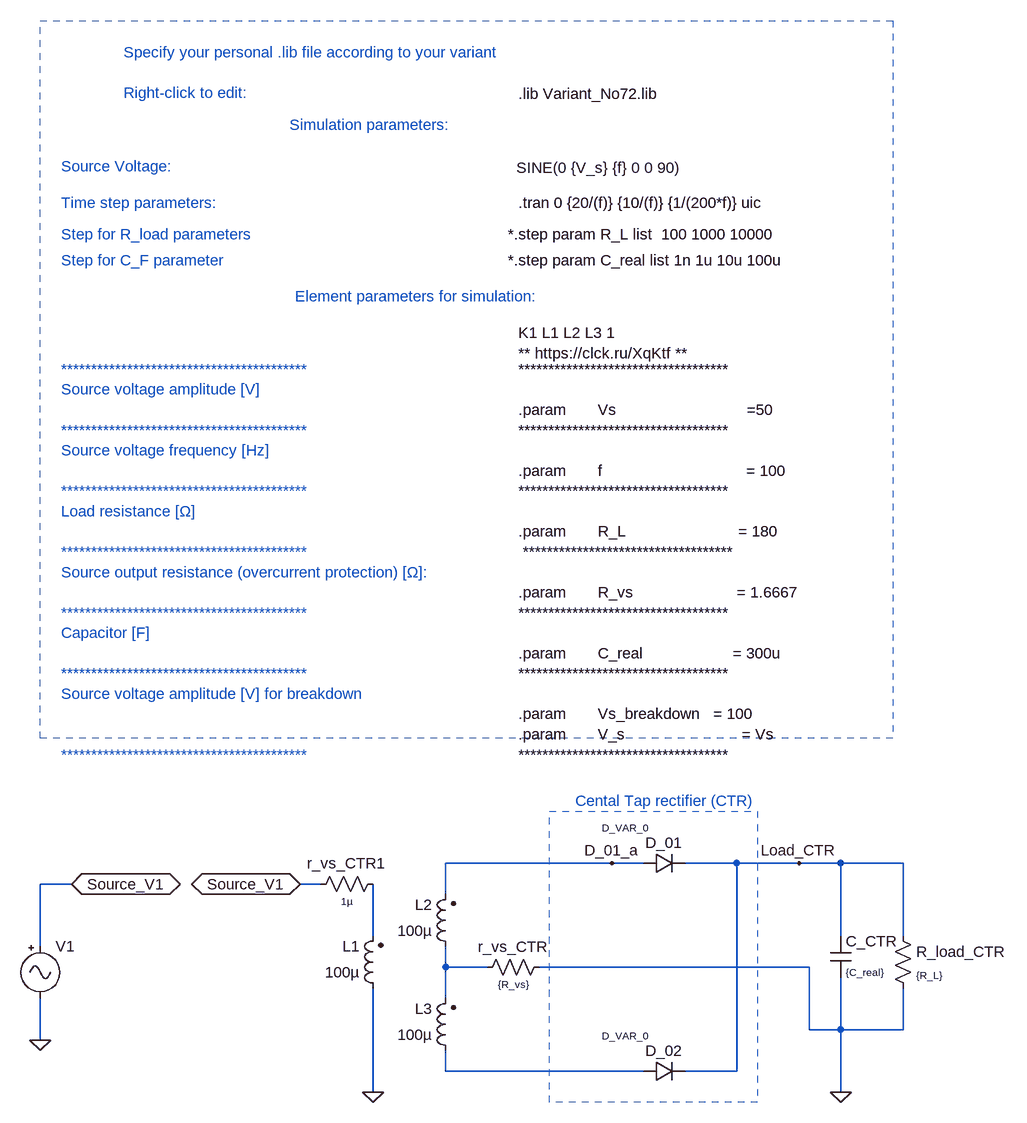
[diagram p0: schematic Lab1_Rectifiers.asc]
Lab1_Rectifiers.asc, the LTspice schematic file:
Version 4
SHEET 1 7368 964
WIRE -688 -288 -944 -288
WIRE -640 -288 -688 -288
WIRE -496 -288 -576 -288
WIRE -400 -288 -496 -288
WIRE -336 -288 -400 -288
WIRE -240 -288 -336 -288
WIRE -1520 -256 -1568 -256
WIRE -1136 -256 -1168 -256
WIRE -944 -240 -944 -288
WIRE -1056 -176 -1056 -256
WIRE -336 -176 -336 -288
WIRE -240 -176 -240 -288
WIRE -1568 -160 -1568 -256
WIRE -944 -128 -944 -160
WIRE -880 -128 -944 -128
WIRE -384 -128 -800 -128
WIRE -944 -80 -944 -128
WIRE -384 -32 -384 -128
WIRE -336 -32 -336 -112
WIRE -336 -32 -384 -32
WIRE -240 -32 -240 -96
WIRE -240 -32 -336 -32
WIRE -1568 -16 -1568 -80
WIRE -944 32 -944 0
WIRE -640 32 -944 32
WIRE -496 32 -496 -288
WIRE -496 32 -576 32
WIRE -1056 64 -1056 -96
WIRE -336 64 -336 -32
FLAG -1568 -16 0
FLAG -1520 -256 Source_V1
IOPIN -1520 -256 BiDir
FLAG -400 -288 Load_CTR
FLAG -336 64 0
FLAG -1168 -256 Source_V1
IOPIN -1168 -256 BiDir
FLAG -1056 64 0
FLAG -688 -288 D_01_a
SYMBOL Misc\\signal -1568 -176 R0
WINDOW 123 0 0 Left 0
WINDOW 39 0 0 Left 0
WINDOW 3 733 -1182 Left 2
SYMATTR Value SINE(0 {V_s} {f} 0 0 90)
SYMATTR InstName V1
SYMBOL ind2 -1040 -80 R180
WINDOW 0 36 80 Left 2
WINDOW 3 36 40 Left 2
SYMATTR InstName L1
SYMATTR Value 100µ
SYMATTR Type ind
SYMBOL ind2 -928 -144 R180
WINDOW 0 36 80 Left 2
WINDOW 3 36 40 Left 2
SYMATTR InstName L2
SYMATTR Value 100µ
SYMATTR Type ind
SYMBOL ind2 -928 16 R180
WINDOW 0 36 80 Left 2
WINDOW 3 36 40 Left 2
SYMATTR InstName L3
SYMATTR Value 100µ
SYMATTR Type ind
SYMBOL diode -640 -272 R270
WINDOW 0 32 32 VTop 2
WINDOW 3 81 -28 VBottom 1
SYMATTR InstName D_01
SYMATTR Value D_VAR_0
SYMBOL diode -640 48 R270
WINDOW 0 32 32 VTop 2
WINDOW 3 81 -28 VBottom 1
SYMATTR InstName D_02
SYMATTR Value D_VAR_0
SYMBOL res -256 -192 R0
WINDOW 3 36 76 Left 1
SYMATTR Value {R_L}
SYMATTR InstName R_load_CTR
SYMATTR SpiceLine tol=5
SYMBOL cap -352 -176 R0
WINDOW 3 24 56 Left 1
SYMATTR Value {C_real}
SYMATTR InstName C_CTR
SYMBOL res -784 -144 R90
WINDOW 0 0 56 VBottom 2
WINDOW 3 32 56 VTop 1
SYMATTR InstName r_vs_CTR
SYMATTR Value {R_vs}
SYMATTR SpiceLine tol=5
SYMBOL res -1040 -272 R90
WINDOW 0 0 56 VBottom 2
WINDOW 3 32 56 VTop 1
SYMATTR InstName r_vs_CTR1
SYMATTR Value 1µ
TEXT -832 -1304 Left 2 !.tran 0 {20/(f)} {10/(f)} {1/(200*f)} uic
TEXT -832 -1472 Left 2 !.lib Variant_No72.lib
TEXT -744 -384 Left 2 ;Cental Tap rectifier (CTR)
TEXT -832 -1104 Left 2 !K1 L1 L2 L3 1\n** https://clck.ru/XqKtf **
TEXT -832 -1048 Left 2 !***********************************\n \n.param       Vs                             =50\n***********************************   \n                                                        \n.param       f                                = 100\n***********************************  \n \n.param       R_L                         = 180\n ***********************************                                                  \n \n.param       R_vs                       = 1.6667\n***********************************  \n \n.param       C_real                    = 300u\n***********************************  \n                                                        \n.param       Vs_breakdown   = 100\n.param       V_s                          = Vs\n***********************************
TEXT -848 -1256 Left 2 !*.step param R_L list  100 1000 10000
TEXT -1440 -1536 Left 2 ;Specify your personal .lib file according to your variant\n \nRight-click to edit:
TEXT -1184 -1424 Left 2 ;Simulation parameters:
TEXT -848 -1216 Left 2 !*.step param C_real list 1n 1u 10u 100u
TEXT -1536 -1256 Left 2 ;Step for R_load parameters
TEXT -1536 -1216 Left 2 ;Step for C_F parameter
TEXT -1176 -1160 Left 2 ;Element parameters for simulation:
TEXT -1536 -1360 Left 2 ;Source Voltage:
TEXT -1536 -1304 Left 2 ;Time step parameters:
TEXT -1536 -1048 Left 2 ;*****************************************\nSource voltage amplitude [V]\n \n*****************************************\nSource voltage frequency [Hz]\n \n*****************************************\nLoad resistance [Ω]\n \n***************************************** \nSource output resistance (overcurrent protection) [Ω]:\n \n*****************************************\nCapacitor [F]\n \n*****************************************\nSource voltage amplitude [V] for breakdown\n \n \n*****************************************
RECTANGLE Normal -464 80 -784 -368 2
RECTANGLE Normal -256 -480 -1568 -1584 2

The netlist it stands for:
* Lab1_Rectifiers.asc
V1 Source_V1 0 SINE(0 {V_s} {f} 0 0 90)
L1 0 N001 100µ
L2 N002 D_01_a 100µ
L3 N003 N002 100µ
D_01 D_01_a Load_CTR D_VAR_0
D_02 N003 Load_CTR D_VAR_0
R_load_CTR Load_CTR 0 {R_L} tol=5
C_CTR Load_CTR 0 {C_real}
r_vs_CTR 0 N002 {R_vs} tol=5
r_vs_CTR1 N001 Source_V1 1µ
.model D D
.lib standard.dio
.tran 0 {20/(f)} {10/(f)} {1/(200*f)} uic
.lib Variant_No72.lib
* Cental Tap rectifier (CTR)
K1 L1 L2 L3 1
** https://clck.ru/XqKtf **
***********************************
.param       Vs                             =50
***********************************
.param       f                                = 100
***********************************
.param       R_L                         = 180
 ***********************************
.param       R_vs                       = 1.6667
***********************************
.param       C_real                    = 300u
***********************************
.param       Vs_breakdown   = 100
.param       V_s                          = Vs
***********************************
*.step param R_L list  100 1000 10000
* Specify your personal .lib file according to your variant
* Right-click to edit:
* Simulation parameters:
*.step param C_real list 1n 1u 10u 100u
* Step for R_load parameters
* Step for C_F parameter
* Element parameters for simulation:
* Source Voltage:
* Time step parameters:
* *****************************************
* Source voltage amplitude [V]
* *****************************************
* Source voltage frequency [Hz]
* *****************************************
* Load resistance [Ω]
* *****************************************
* Source output resistance (overcurrent protection) [Ω]:
* *****************************************
* Capacitor [F]
* *****************************************
* Source voltage amplitude [V] for breakdown
* *****************************************
.backanno
.end

* Results of the author's LTspice run, read from the files saved beside the schematic
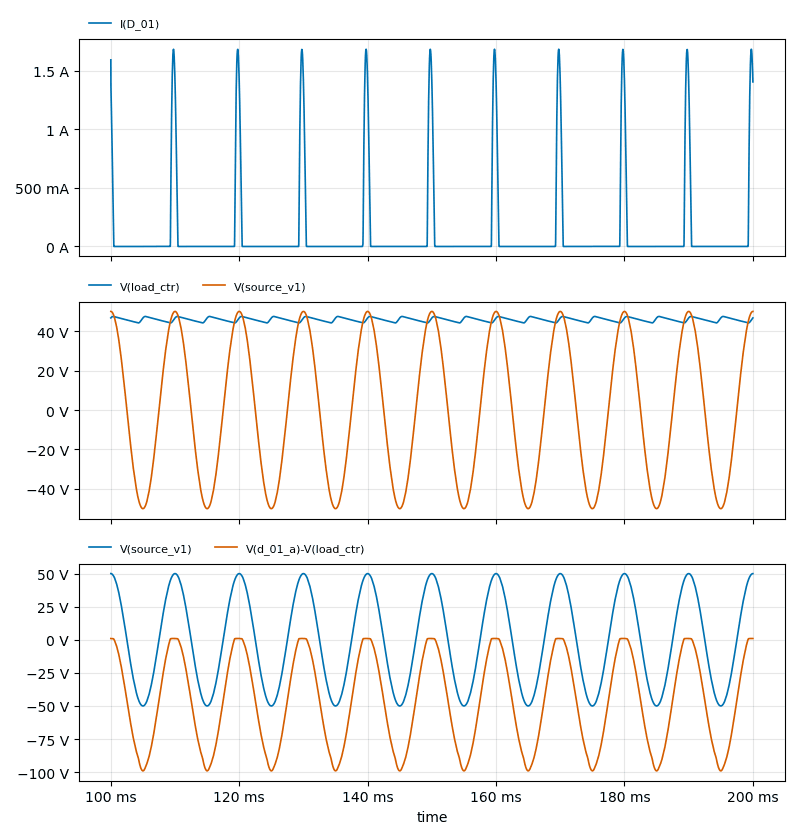
[diagram p1: Transient Analysis of Lab1_Rectifiers.asc, plotted from the saved traces]
* Transient Analysis, 1 run:
*   I(D_01): min -296.3 nA, max 1.684 A, average 126.7 mA, rms 411.3 mA, last 1.405 A
*   V(load_ctr): min 44.16 V, max 47.45 V, average 45.82 V, rms 45.83 V, last 46.71 V
*   V(source_v1): min -50 V, max 50 V, average -1.541 mV, rms 35.4 V, last 50 V
*   V(source_v1): min -50 V, max 50 V, average -1.541 mV, rms 35.4 V, last 50 V
*   V(d_01_a)-V(load_ctr): min -99.03 V, max 971.8 mV, average -46.24 V, rms 58.25 V, last 950.1 mV